# Altium schematic sheet CoverPage.SchDoc
size A; SheetNumber: 1; SheetTotal: 12
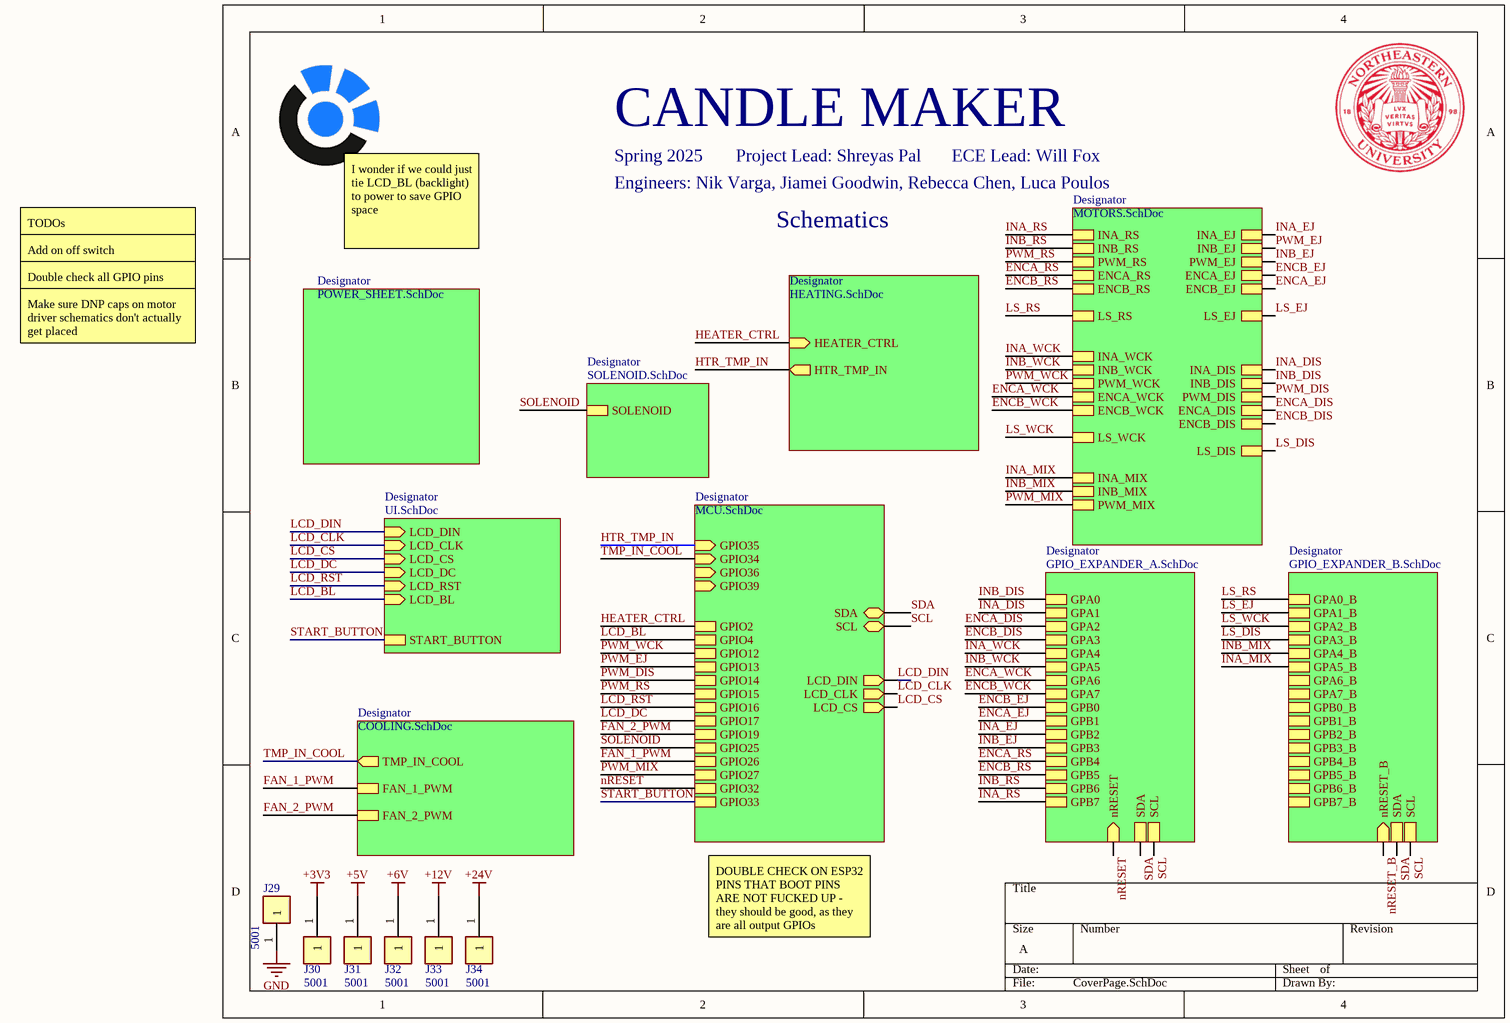
[diagram p0: CoverPage.SchDoc]

## Parts
J29  5001  [FP-5001-MFG]
J30  5001  [FP-5001-MFG]
J31  5001  [FP-5001-MFG]
J32  5001  [FP-5001-MFG]
J33  5001  [FP-5001-MFG]
J34  5001  [FP-5001-MFG]

## Sub-sheets
Designator = HEATING.SchDoc: HEATER_CTRL (in), HTR_TMP_IN (out)
Designator = MCU.SchDoc: GPIO35 (in), SDA (bidir), SCL (bidir), LCD_DIN (out), LCD_CLK (out), LCD_CS (out), GPIO2, GPIO4, GPIO12, GPIO13, GPIO14, GPIO15, GPIO16, GPIO17, GPIO19, GPIO25, GPIO26, GPIO27, GPIO32, GPIO33, GPIO34 (in), GPIO36 (in), GPIO39 (in)
Designator = MOTORS.SchDoc: INA_RS, INB_RS, PWM_RS, ENCA_RS, ENCB_RS, LS_RS, INA_WCK, INB_WCK, PWM_WCK, ENCA_WCK, ENCB_WCK, LS_WCK, INA_MIX, INB_MIX, PWM_MIX, INA_EJ, INB_EJ, PWM_EJ, ENCA_EJ, ENCB_EJ, LS_EJ, INA_DIS, INB_DIS, PWM_DIS, ENCA_DIS, ENCB_DIS, LS_DIS
Designator = COOLING.SchDoc: TMP_IN_COOL (out), FAN_1_PWM, FAN_2_PWM
Designator = POWER_SHEET.SchDoc: no entries
Designator = UI.SchDoc: LCD_DIN (in), LCD_CLK (in), LCD_CS (in), LCD_DC (in), LCD_RST (in), LCD_BL (in), START_BUTTON
Designator = GPIO_EXPANDER_A.SchDoc: GPA0, GPA1, GPA2, GPA3, GPA4, GPA5, GPA6, GPA7, GPB0, GPB1, GPB2, GPB3, GPB4, GPB5, GPB6, GPB7, SCL, SDA, nRESET (in)
Designator = GPIO_EXPANDER_B.SchDoc: SCL, SDA, GPA0_B, GPA1_B, GPA2_B, GPA3_B, GPA4_B, GPA5_B, GPA6_B, GPA7_B, GPB0_B, GPB1_B, GPB2_B, GPB3_B, GPB4_B, GPB5_B, GPB6_B, GPB7_B, nRESET_B (in)
Designator = SOLENOID.SchDoc: SOLENOID

## Nets
+3V3: J30.1
+5V: J31.1
+6V: J32.1
+12V: J33.1
+24V: J34.1
GND: J29.1
ENCA_DIS: sheet Designator/ENCA_DIS, sheet Designator/GPA2
ENCA_EJ: sheet Designator/ENCB_EJ, sheet Designator/GPB1
ENCA_RS: sheet Designator/ENCA_RS, sheet Designator/GPB4
ENCA_WCK: sheet Designator/ENCA_WCK, sheet Designator/GPA6
ENCB_DIS: sheet Designator/ENCB_DIS, sheet Designator/GPA3
ENCB_EJ: sheet Designator/ENCA_EJ, sheet Designator/GPB0
ENCB_RS: sheet Designator/ENCB_RS, sheet Designator/GPB5
ENCB_WCK: sheet Designator/ENCB_WCK, sheet Designator/GPA7
FAN_1_PWM: sheet Designator/GPIO26, sheet Designator/FAN_1_PWM
FAN_2_PWM: sheet Designator/GPIO19, sheet Designator/FAN_2_PWM
HEATER_CTRL: sheet Designator/HEATER_CTRL, sheet Designator/GPIO2
HTR_TMP_IN: sheet Designator/HTR_TMP_IN, sheet Designator/GPIO35
INA_DIS: sheet Designator/INA_DIS, sheet Designator/GPA1
INA_EJ: sheet Designator/INA_EJ, sheet Designator/GPB2
INA_MIX: sheet Designator/INA_MIX, sheet Designator/GPA5_B
INA_RS: sheet Designator/INA_RS, sheet Designator/GPB7
INA_WCK: sheet Designator/INA_WCK, sheet Designator/GPA4
INB_DIS: sheet Designator/INB_DIS, sheet Designator/GPA0
INB_EJ: sheet Designator/PWM_EJ, sheet Designator/GPB3
INB_MIX: sheet Designator/INB_MIX, sheet Designator/GPA4_B
INB_RS: sheet Designator/INB_RS, sheet Designator/GPB6
INB_WCK: sheet Designator/INB_WCK, sheet Designator/GPA5
LCD_BL: sheet Designator/GPIO4, sheet Designator/LCD_BL
LCD_CLK: sheet Designator/LCD_CLK, sheet Designator/LCD_CLK
LCD_CS: sheet Designator/LCD_CS, sheet Designator/LCD_CS
LCD_DC: sheet Designator/GPIO17, sheet Designator/LCD_DC
LCD_DIN: sheet Designator/LCD_DIN, sheet Designator/LCD_DIN
LCD_RST: sheet Designator/GPIO16, sheet Designator/LCD_RST
LS_DIS: sheet Designator/LS_DIS, sheet Designator/GPA3_B
LS_EJ: sheet Designator/LS_EJ, sheet Designator/GPA1_B
LS_RS: sheet Designator/LS_RS, sheet Designator/GPA0_B
LS_WCK: sheet Designator/LS_WCK, sheet Designator/GPA2_B
nRESET: sheet Designator/GPIO32, sheet Designator/nRESET
nRESET_B: sheet Designator/nRESET_B
PWM_DIS: sheet Designator/GPIO14, sheet Designator/PWM_DIS
PWM_EJ: sheet Designator/GPIO13, sheet Designator/INB_EJ
PWM_MIX: sheet Designator/GPIO27, sheet Designator/PWM_MIX
PWM_RS: sheet Designator/GPIO15, sheet Designator/PWM_RS
PWM_WCK: sheet Designator/GPIO12, sheet Designator/PWM_WCK
SCL: sheet Designator/SCL, sheet Designator/SCL, sheet Designator/SCL
SDA: sheet Designator/SDA, sheet Designator/SDA, sheet Designator/SDA
SOLENOID: sheet Designator/GPIO25, sheet Designator/SOLENOID
START_BUTTON: sheet Designator/GPIO33, sheet Designator/START_BUTTON
TMP_IN_COOL: sheet Designator/GPIO34, sheet Designator/TMP_IN_COOL

## Notes on the sheet
- CANDLE MAKER
- Spring 2025
- Project Lead: Shreyas Pal
- ECE Lead: Will Fox
- TODOs
- Engineers: Nik Varga, Jiamei Goodwin, Rebecca Chen, Luca Poulos
- Schematics
- Add on off switch
- Double check all GPIO pins
- I wonder if we could just tie LCD_BL (backlight) to power to save GPIO space
- Make sure DNP caps on motor driver schematics don't actually get placed
- DOUBLE CHECK ON ESP32 PINS THAT BOOT PINS ARE NOT FUCKED UP - they should be good, as they are all output GPIOs

## Library data of the parts
J29-J34 = CMP-2000-05181-2: PC TEST POINT MINIATURE BLACK; Body Material: Bronze; Plating: Silver; Inside Diameter: 1.27mm; Hole Diameter: 1.6mm; Number of Ports: 1; Outside Diameter: 2.54mm; Insulation: Insulated; Insulation Material: Nylon; Mount: Through Hole; RoHS Compliant: Yes; Series: THM; Height: 0.3inch; Termination: Through Hole; Material: Nylon; Packaging: Bulk; Contact Material: Bronze; REACH SVHC: No SVHC; Contact Plating: Silver; Orientation: Straight; Lead Free: Lead Free; Package Quantity: 100; Length: 7.62mm; Flammability Rating: UL94 V-0; Number of Contacts: 1; Diameter: 2.54mm; Housing Color: Black; Color: Black